# Altium schematic sheet db25.SchDoc: Hall / Hub Board / DB25
size A4; DocumentNumber: 3; SheetNumber: 3; SheetTotal: 7
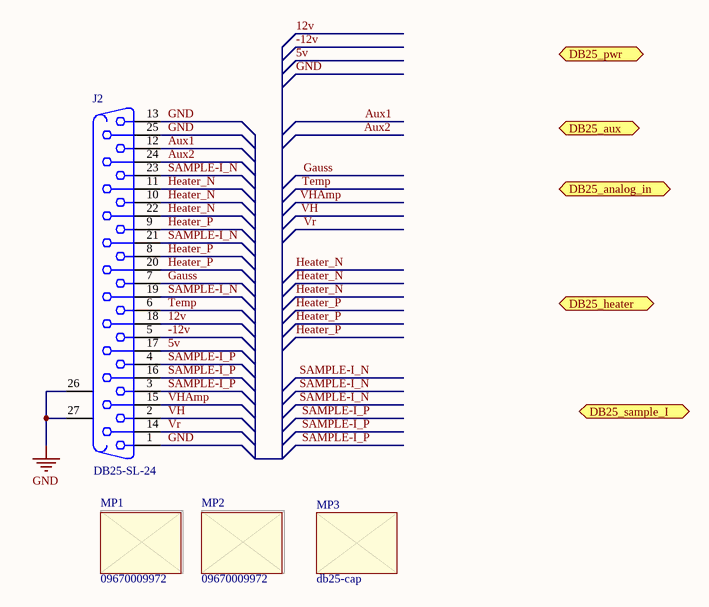
[diagram p0: db25.SchDoc]

## Parts
J2  Manufacturer Part Number: DB25-SL-24  [DB25]
MP1  09670009972  (mechanical)
MP2  09670009972  (mechanical)
MP3  db25-cap  (mechanical)

## Ports
DB25_analog_in (harness DB25_analog_in), DB25_aux (harness DB25_aux), DB25_heater (harness DB25_heater), DB25_pwr (harness DB25_pwr), DB25_sample_I (harness DB25_sample_I)

## Nets
GND: J2.1 J2.13 J2.25 J2.26(MH1) J2.27(MH2)
5v: J2.17
12v: J2.18
-12v: J2.5
Aux1: J2.12
Aux2: J2.24
Gauss: J2.7
Heater_N: J2.10 J2.11 J2.22
Heater_P: J2.8 J2.9 J2.20
SAMPLE-I_N: J2.19 J2.21 J2.23
SAMPLE-I_P: J2.3 J2.4 J2.16
Temp: J2.6
VH: J2.2
VHAmp: J2.15
Vr: J2.14

## Notes on the sheet
- Title
- Size:
- Date:
- A4
- Number:
- Time:
- Revision:
- Sheet
- of
- Fermium LABS srl
- Via Monselice 15a
- 35142 Padova PD
- Italy
- File:

## Library data of the parts
J2 = D Connector 25: d-sub, 25 pins,  Right Angle; Manufacturer: ADAM TECH; Pads: 29 THT; Supplier 1: TME; Supplier Part Number 1: DB25-SL-24; Category: D-Sub connectors
MP1 MP2 = 09670009972: Manufacturer: HARTING; Supplier 1: TME; Supplier Part Number 1: 09670009972; Manufacturer Part Number: 09670009972
MP3 = db25-cap: Manufacturer Part Number: 2105-0100-03; Manufacturer: Encitech; Supplier 1: TME; Supplier Part Number 1: DC25-P